# Altium schematic sheet Power_Supply_2.SchDoc
size A4; CompanyName: Technische Hochschule Nürnberg Georg Simon Ohm; Organization: UltraZohm; Address1: Kesslerplatz 12; Address2: 90489 Nürnberg; Address3: GERMANY; SheetNumber: 28; Website: www.ultrazohm.com
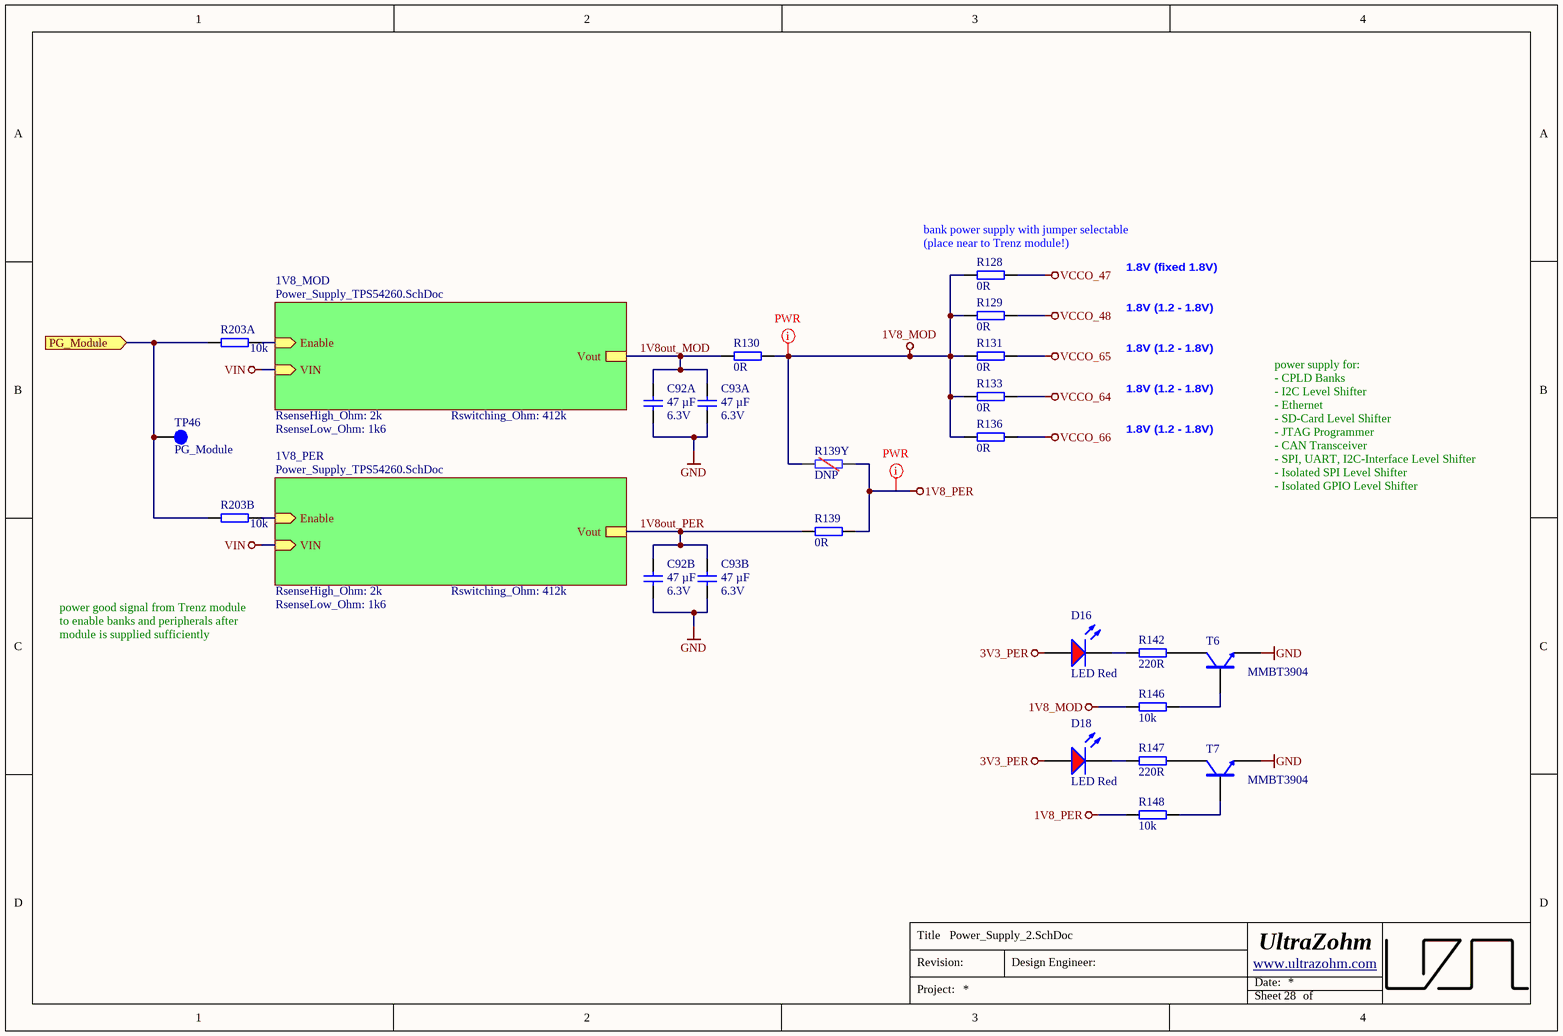
[diagram p0: Power_Supply_2.SchDoc]

## Parts
C92A  47 µF  Voltage: 6.3V  [C_0805_TE]
C92B  47 µF  Voltage: 6.3V  [C_0805_TE]
C93A  47 µF  Voltage: 6.3V  [C_0805_TE]
C93B  47 µF  Voltage: 6.3V  [C_0805_TE]
D16  LED Red  [WL-SMCW_0603]
D18  LED Red  [WL-SMCW_0603]
R128  0R  [R_1206_TE]
R129  0R  [R_1206_TE]
R130  0R  [R_1206_TE]
R131  0R  [R_1206_TE]
R133  0R  [R_1206_TE]
R136  0R  [R_1206_TE]
R139  0R  [R_1206_TE]
R139Y  DNP  [R_1206_TE-DNP]  (no BOM)
R142  220R  [R_0603_TE]
R146  10k  [R_0603_TE]
R147  220R  [R_0603_TE]
R148  10k  [R_0603_TE]
R203A  10k  [R_0603_TE]
R203B  10k  [R_0603_TE]
T6  MMBT3904  [SOT95P280X145-3N]
T7  MMBT3904  [SOT95P280X145-3N]
TP46  PG_Module  [TP_1mm]  (no BOM)

## Sub-sheets
1V8_MOD = Power_Supply_TPS54260.SchDoc: Vout, Enable (in), VIN (in)  | RsenseHigh_Ohm: 2k; RsenseLow_Ohm: 1k6; Rswitching_Ohm: 412k; SubSheet_SheetNumber: 28.1; Output_V: 1.8
1V8_PER = Power_Supply_TPS54260.SchDoc: Vout, Enable (in), VIN (in)  | RsenseHigh_Ohm: 2k; RsenseLow_Ohm: 1k6; Rswitching_Ohm: 412k; SubSheet_SheetNumber: 28.2; Output_V: 1.8

## Ports
PG_Module (in)

## Nets
1V8_MOD: R128.1 R129.1 R130.2 R131.1 R133.1 R136.1 R139Y.1 R146.1
1V8_PER: R139.2 R139Y.2 R148.1
3V3_PER: D16.2(A) D18.2(A)
GND: C92A.1 C92B.1 C93A.1 C93B.1 T6.2(EMITTER) T7.2(EMITTER)
VCCO_47: R128.2
VCCO_48: R129.2
VCCO_64: R133.2
VCCO_65: R131.2
VCCO_66: R136.2
VIN: sheet 1V8_PER/VIN, sheet 1V8_MOD/VIN
1V8out_MOD: C92A.2 C93A.2 R130.1 ; sheet 1V8_MOD/Vout
1V8out_PER: C92B.2 C93B.2 R139.1 ; sheet 1V8_PER/Vout
PG_Module: R203A.1 R203B.1 TP46.1 ; port PG_Module
NetD16_1: D16.1(K) R142.1
NetD18_1: D18.1(K) R147.1
NetR142_2: R142.2 T6.3(COLLECTOR)
NetR146_2: R146.2 T6.1(BASIS)
NetR147_2: R147.2 T7.3(COLLECTOR)
NetR148_2: R148.2 T7.1(BASIS)
NetR203A_2: R203A.2 ; sheet 1V8_MOD/Enable
NetR203B_2: R203B.2 ; sheet 1V8_PER/Enable

## Layout directives
net class PWR: 1V8_MOD, 1V8_PER

## Notes on the sheet
- (near R128) bank power supply with jumper selectable
  (place near to Trenz module!)
- 1.8V (fixed 1.8V)
- 1.8V (1.2 - 1.8V)
- power supply for:
  - CPLD Banks
  - I2C Level Shifter
  - Ethernet
  - SD-Card Level Shifter
  - JTAG Programmer
  - CAN Transceiver
  - SPI, UART, I2C-Interface Level Shifter
  - Isolated SPI Level Shifter
  - Isolated GPIO Level Shifter
- power good signal from Trenz module to enable banks and peripherals after module is supplied sufficiently
- Title
- Revision:
- Design Engineer:
- Date:
- Project:
- Sheet
- of

## Library data of the parts
C92A C92B C93A C93B = UZgen_C_0805_47uF_6.3V_X7R: Generic capacitor; Manufacturer: UZgen; Tolerance: 10 %; Created from: UZgenTool; Value: 47 µF; Technology: X7R; Manufacturer Part Number: UZgen_C_0805_47uF_6.3V_X7R; PartID: 5223; Created On: 02/08/2024 11:18:30; Device Package: 0805; Mounting Type: SMD; Last Updated: 02/08/2024 11:18:30
D16 D18 = UZgen_LED_0603_Red: Standard LEDs - SMD 0603 red; Manufacturer: UZgen; Created from: UZgenTool; Manufacturer Part Number: UZgen_LED_0603_Red; PartID: 22; Created On: 09/09/2024 10:45:01; ComponentLink1Description: N/A; ComponentLink1URL: N/A; Component Type: LED Diode; Device Package: 0603; Last Updated: 09/09/2024 10:45:01; Mounting Type: SMD; Supplier 1: LCSC; Supplier Part Number 1: =LCSC Part Number; Type: Standard; Live Cycle Status: 1; Stock number: not stored; Color: red; Value: LED Red
R128-R131 R133 R136 R139 = UZgen_R_1206_0R: Generic resistor; Manufacturer: UZgen; Tolerance: 1 %; Created from: UZgenTool; Value: 0R; Manufacturer Part Number: UZgen_R_1206_0R; PartID: 583; Created On: 08.07.2024 14:34:30; Device Package: 1206; Mounting Type: SMD; Last Updated: 08.07.2024 14:34:30
R139Y = UZgen_R_1206_DNP: Generic resistor (DNP); Manufacturer: UZgen; Created from: UZgenTool; Value: DNP; Tolerance: -; Manufacturer Part Number: UZgen_R_1206_DNP; PartID: 595; Created On: 25/03/2025 14:26:15; Device Package: 1206; Mounting Type: SMD; Last Updated: 02/04/2025 19:05:00
R142 R147 = UZgen_R_0603_220R: Generic resistor; Manufacturer: UZgen; Tolerance: 1 %; Created from: UZgenTool; Value: 220R; Manufacturer Part Number: UZgen_R_0603_220R; PartID: 205; Created On: 02.07.2024 17:29:49; Device Package: 0603; Mounting Type: SMD; Last Updated: 02.07.2024 17:29:49
R146 R148 R203A R203B = UZgen_R_0603_10k: Generic resistor; Manufacturer: UZgen; Tolerance: 1 %; Created from: AGeiger; Value: 10k; Manufacturer Part Number: UZgen_R_0603_10k; PartID: 1; Created On: 02.07.2024 14:34:53; Device Package: 0603; Mounting Type: SMD; Last Updated: 02.07.2024 14:37:16
T6 T7 = MMBT3904: Bipolartransistor, 40V 200mW 200mA 100@10mA,1V 300MHz 300mV@50mA,5mA NPN +150℃@(Tj) SOT-23(SOT-23-3); Manufacturer: Jiangsu Changjing Electronics Technology Co., Ltd.; Number Of Channels: single; Collector Basis Voltage: 60 V; Created from: NDiringer; Manufacturer Part Number: MMBT3904; PartID: 2; Created On: 10.06.2022 12:04:49; ComponentLink1Description: Datasheet; ComponentLink1URL: https://datasheet.lcsc.com/lcsc/1811011934_Jiangsu-Changjing-Electronics-Technology-Co---Ltd--MMBT3904_C20526.pdf; Component Type: Bipolartransistor; Device Package: SOT-23-3; Last Updated: 10.08.2022 13:48:16; Mounting Type: SMD; Operating Temperature: -55 - 150 °C; Series: MMBT3904; Supplier 1: Mouser; Supplier Part Number 1: MMBT3904; Supplier 2: LCSC/JLCPCB; Supplier Part Number 2: C20526; Type: Bipolartransistor; Collector Emitter Voltage: 40 V; Polarization: NPN; Power Dissipation: 200 mW; Value: 40 V; Live Cycle Status: 1; LCSC Part Number: C20526
TP46 = NULL: Testpoint 1mm; Manufacturer Part Number: NULL; Created from: AGeiger; Created: 2018_06_25_AGeiger; Value: PG_Module; PartID: 9; Created On: 20/09/2022 13:14:57; Component Type: Testpoint; Last Updated: 20/09/2022 13:15:39; Manufacturer: NULL; Supplier 1: NULL; Supplier Part Number 1: NULL; Type: Testpoint; Live Cycle Status: 1